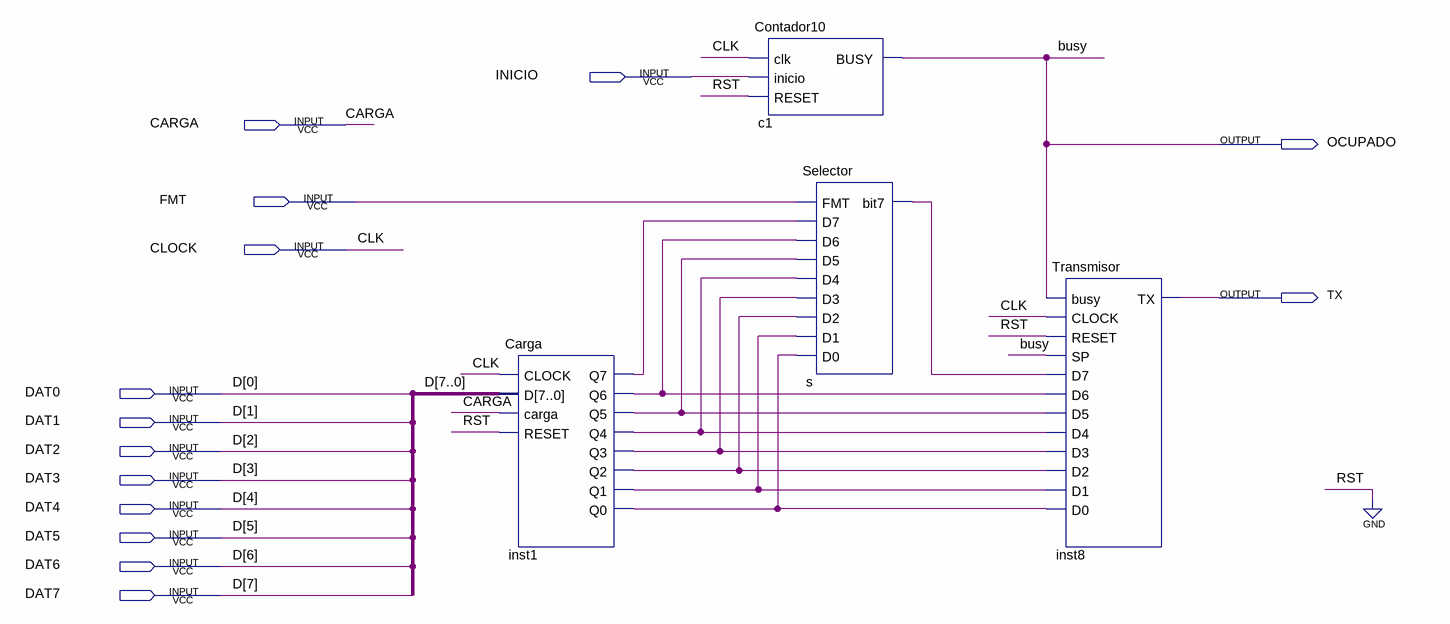
[diagram p0: schematic sheet]
// Quartus schematic UART1.bdf as structural Verilog: 4 symbols, 14 pins
module UART1 (
  input  INICIO,
  input  CARGA,
  input  FMT,
  input  CLOCK,
  input  DAT0,
  input  DAT1,
  input  DAT2,
  input  DAT3,
  input  DAT4,
  input  DAT5,
  input  DAT6,
  input  DAT7,
  output OCUPADO,
  output TX
);

  wire inst1_q0, inst1_q1, inst1_q2, inst1_q3, inst1_q4, inst1_q5, inst1_q6, inst1_q7, s_bit7;

  Carga inst1 (
    .CLOCK(CLOCK), .D({DAT7, DAT6, DAT5, DAT4, DAT3, DAT2, DAT1, DAT0}), .carga(CARGA), .RESET(1'b0),
    .Q7(inst1_q7), .Q6(inst1_q6), .Q5(inst1_q5), .Q4(inst1_q4), .Q3(inst1_q3), .Q2(inst1_q2), .Q1(inst1_q1),
    .Q0(inst1_q0));
  Contador10 c1 (.clk(CLOCK), .inicio(INICIO), .RESET(1'b0), .BUSY(OCUPADO));
  Selector s (
    .FMT(FMT), .D7(inst1_q7), .D6(inst1_q6), .D5(inst1_q5), .D4(inst1_q4), .D3(inst1_q3), .D2(inst1_q2),
    .D1(inst1_q1), .D0(inst1_q0), .bit7(s_bit7));
  Transmisor inst8 (
    .busy(OCUPADO), .CLOCK(CLOCK), .RESET(1'b0), .SP(OCUPADO), .D7(s_bit7), .D6(inst1_q6), .D5(inst1_q5),
    .D4(inst1_q4), .D3(inst1_q3), .D2(inst1_q2), .D1(inst1_q1), .D0(inst1_q0), .TX(TX));

  // Other names for the same wires on the sheet: CLK = CLOCK;
  //   D[7:0] = {DAT7, DAT6, DAT5, DAT4, DAT3, DAT2, DAT1, DAT0}; busy = OCUPADO
endmodule
